# Altium schematic sheet legacy-codec.SchDoc: audiolab
size A3; Author: Martín Ramírez Espinosa; Revision: 1.0; SheetNumber: 2; SheetTotal: 3
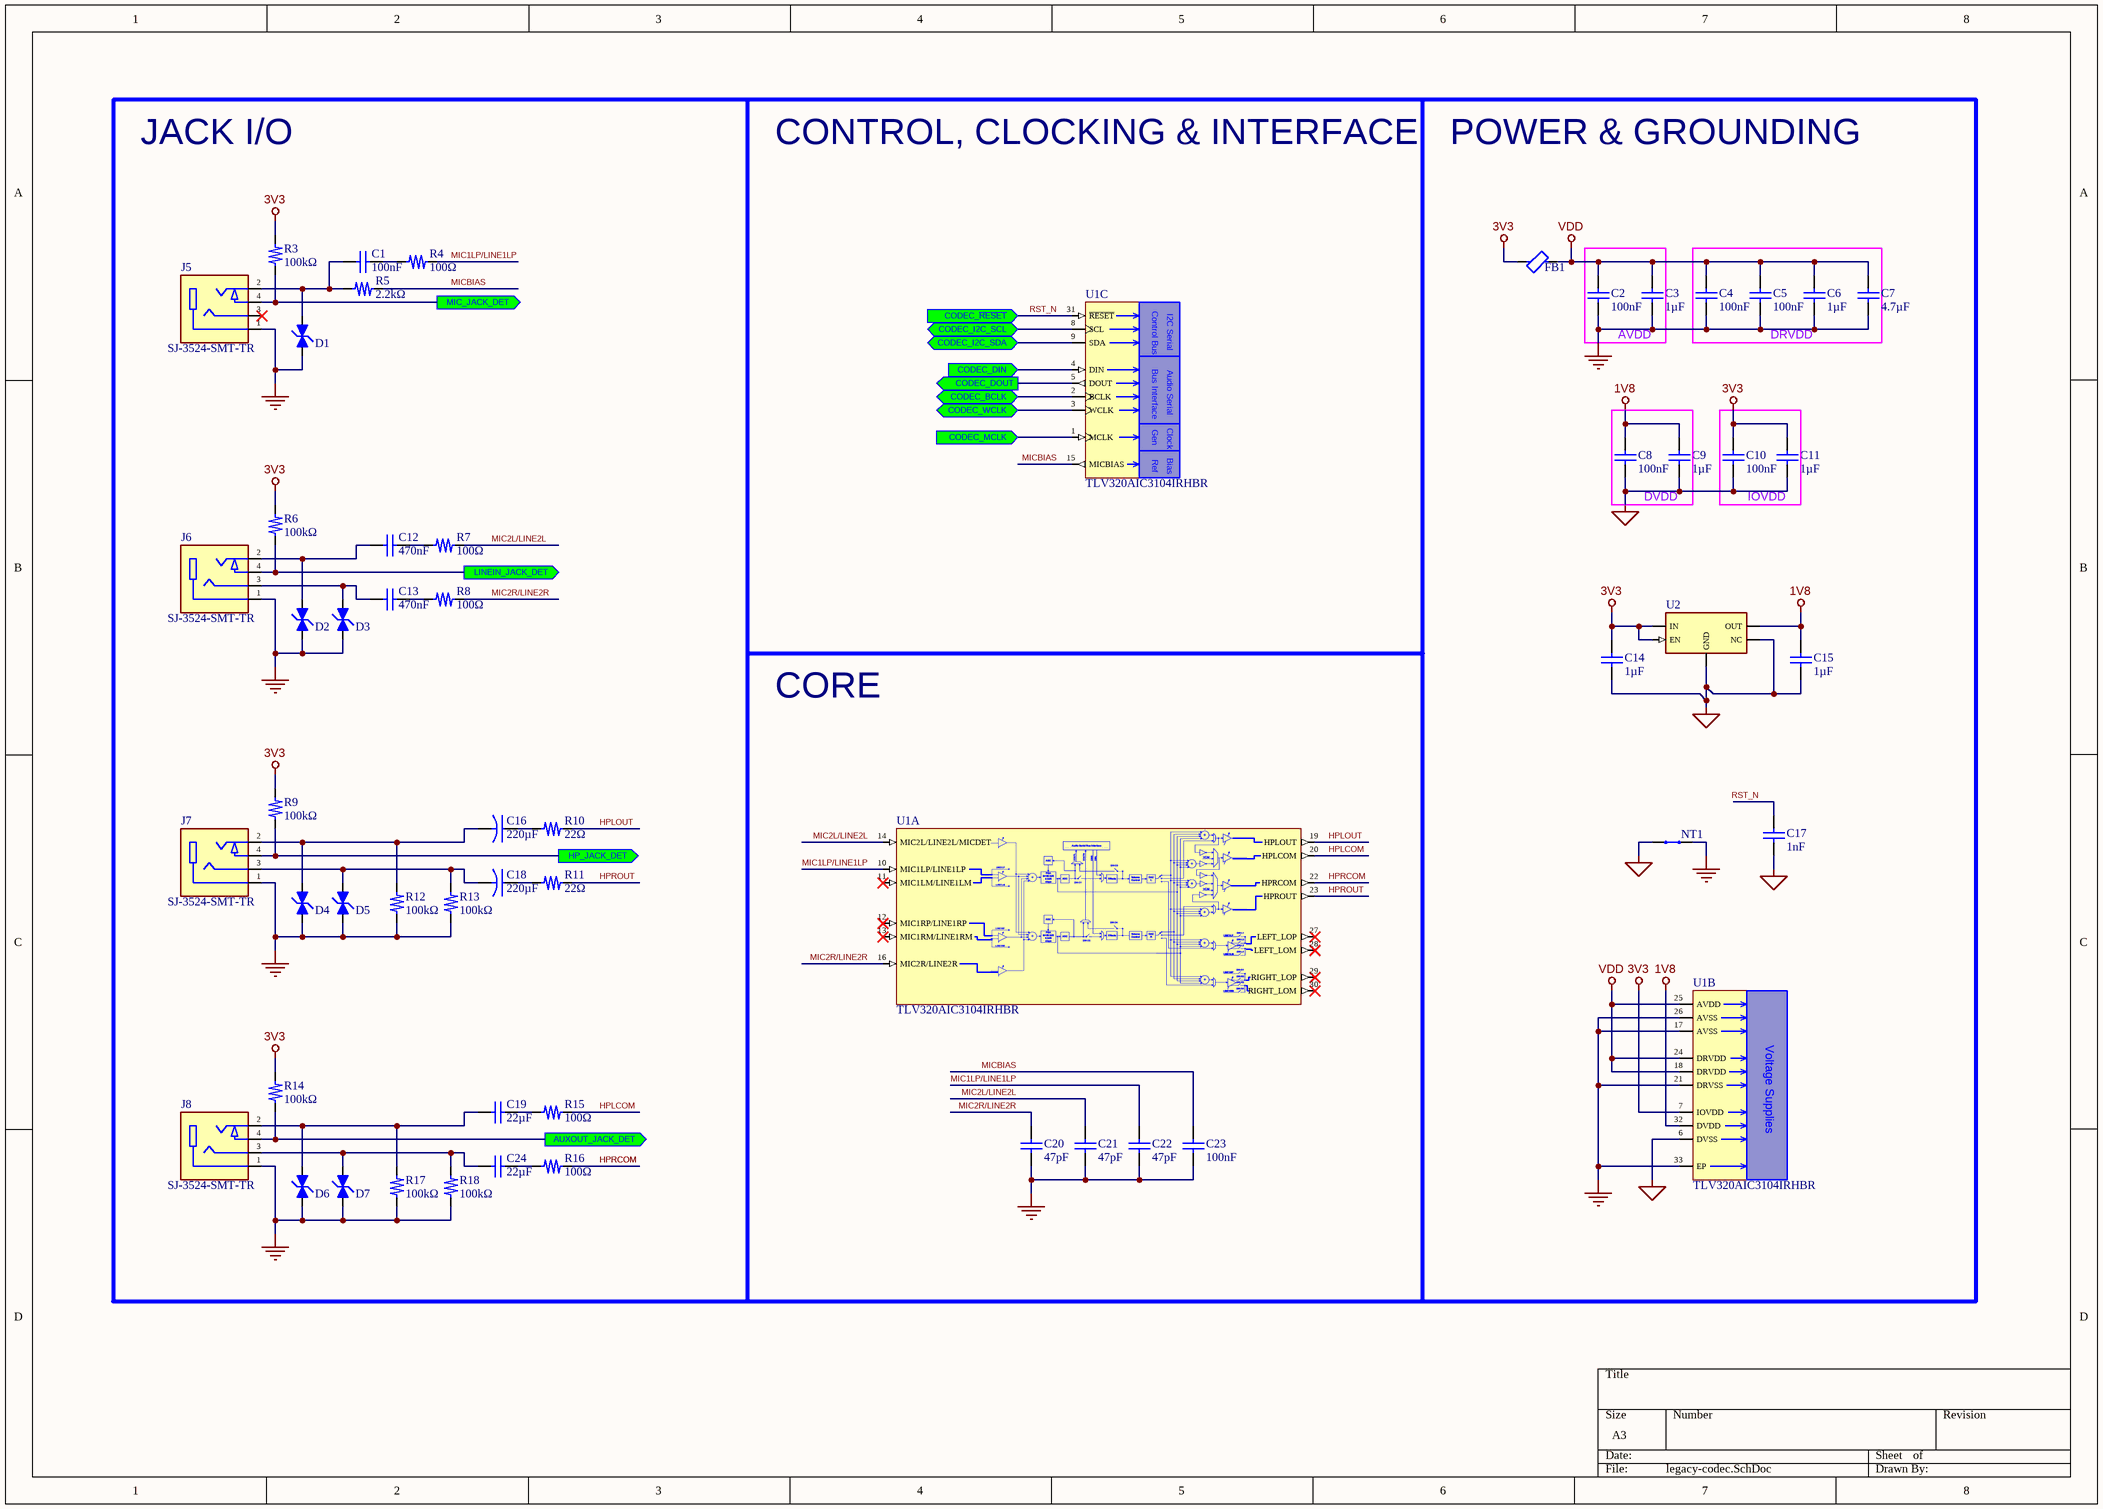
[diagram p0: legacy-codec.SchDoc]

## Parts
C1  value 100nF  [CAPC2012X135N]  (hidden comment: CC0805KRX7R9BB104)
C2  value 100nF  [CAPC2012X135N]  (hidden comment: CC0805KRX7R9BB104)
C3  value 1µF  [CAPC2012X135N]  (hidden comment: CL21B105KBFNNNE)
C4  value 100nF  [CAPC2012X135N]  (hidden comment: CC0805KRX7R9BB104)
C5  value 100nF  [CAPC2012X135N]  (hidden comment: CC0805KRX7R9BB104)
C6  value 1µF  [CAPC2012X135N]  (hidden comment: CL21B105KBFNNNE)
C7  value 4.7µF  [CAPC2012X135N]  (hidden comment: CC0805KKX5R8BB475)
C8  value 100nF  [CAPC2012X135N]  (hidden comment: CC0805KRX7R9BB104)
C9  value 1µF  [CAPC2012X135N]  (hidden comment: CL21B105KBFNNNE)
C10  value 100nF  [CAPC2012X135N]  (hidden comment: CC0805KRX7R9BB104)
C11  value 1µF  [CAPC2012X135N]  (hidden comment: CL21B105KBFNNNE)
C12  value 470nF  [CAPC2012X135N]  (hidden comment: C0805C474K5RECTU)
C13  value 470nF  [CAPC2012X135N]  (hidden comment: C0805C474K5RECTU)
C14  value 1µF  [CAPC2012X135N]  (hidden comment: CL21B105KBFNNNE)
C15  value 1µF  [CAPC2012X135N]  (hidden comment: CL21B105KBFNNNE)
C16  value 220µF  [CAPPRD500W60D800H1150]  (hidden comment: EEU-FR1E221B)
C17  value 1nF  [CAPC2012X135N]  (hidden comment: C0805C102KDRACAUTO)
C18  value 220µF  [CAPPRD500W60D800H1150]  (hidden comment: EEU-FR1E221B)
C19  value 22µF  [CAPC2012X135N]  (hidden comment: GRM21BR61A226ME44L)
C20  value 47pF  [CAPC2012X135N]  (hidden comment: CL21C470JBANNNC)
C21  value 47pF  [CAPC2012X135N]  (hidden comment: CL21C470JBANNNC)
C22  value 47pF  [CAPC2012X135N]  (hidden comment: CL21C470JBANNNC)
C23  value 100nF  [CAPC2012X135N]  (hidden comment: CC0805KRX7R9BB104)
C24  value 22µF  [CAPC2012X135N]  (hidden comment: GRM21BR61A226ME44L)
D1  0402ESDA-AEC1  [0402ESDAAEC1-MFR]  (value not drawn)
D2  0402ESDA-AEC1  [0402ESDAAEC1-MFR]  (value not drawn)
D3  0402ESDA-AEC1  [0402ESDAAEC1-MFR]  (value not drawn)
D4  0402ESDA-AEC1  [0402ESDAAEC1-MFR]  (value not drawn)
D5  0402ESDA-AEC1  [0402ESDAAEC1-MFR]  (value not drawn)
D6  0402ESDA-AEC1  [0402ESDAAEC1-MFR]  (value not drawn)
D7  0402ESDA-AEC1  [0402ESDAAEC1-MFR]  (value not drawn)
FB1  BLM21PG221SN1D  [FP-BLM21-0_2-t0_85-e0_5-MFG]  (value not drawn)
J5  SJ-3524-SMT-TR  [AUDIOJACK_RA_SMT_3P5_TRS_1SW]
J6  SJ-3524-SMT-TR  [AUDIOJACK_RA_SMT_3P5_TRS_1SW]
J7  SJ-3524-SMT-TR  [AUDIOJACK_RA_SMT_3P5_TRS_1SW]
J8  SJ-3524-SMT-TR  [AUDIOJACK_RA_SMT_3P5_TRS_1SW]
NT1  NetTie_SMD  [NETTIE_SMD]  (value not drawn)  (net tie, no BOM)
R3  value 100kΩ  [RESC2012]  (hidden comment: RC0805FR-07100KL)
R4  value 100Ω  [RESC2012]  (hidden comment: RC0805FR-07100RL)
R5  value 2.2kΩ  [RESC2012]  (hidden comment: RC0805FR-072K2L)
R6  value 100kΩ  [RESC2012]  (hidden comment: RC0805FR-07100KL)
R7  value 100Ω  [RESC2012]  (hidden comment: RC0805FR-07100RL)
R8  value 100Ω  [RESC2012]  (hidden comment: RC0805FR-07100RL)
R9  value 100kΩ  [RESC2012]  (hidden comment: RC0805FR-07100KL)
R10  value 22Ω  [RESC2012]  (hidden comment: CR0805-JW-220ELF)
R11  value 22Ω  [RESC2012]  (hidden comment: CR0805-JW-220ELF)
R12  value 100kΩ  [RESC2012]  (hidden comment: RC0805FR-07100KL)
R13  value 100kΩ  [RESC2012]  (hidden comment: RC0805FR-07100KL)
R14  value 100kΩ  [RESC2012]  (hidden comment: RC0805FR-07100KL)
R15  value 100Ω  [RESC2012]  (hidden comment: RC0805FR-07100RL)
R16  value 100Ω  [RESC2012]  (hidden comment: RC0805FR-07100RL)
R17  value 100kΩ  [RESC2012]  (hidden comment: RC0805FR-07100KL)
R18  value 100kΩ  [RESC2012]  (hidden comment: RC0805FR-07100KL)
U1  TLV320AIC3104IRHBR  [QFN50P500X500X100_HS-33N]  (parts A,B,C of 3)
U2  TLV70018DDCR  [SOT95P280X110-5N]  (value not drawn)

## Blocks framed on the sheet
AVDD: C2 C3
DRVDD: C4-C7
DVDD: C8 C9
IOVDD: C10 C11

## Ports
AUXOUT_JACK_DET (out, see audiolab[3C]), CODEC_BCLK (bidir, see audiolab[3B]), CODEC_DIN (in, see audiolab[3C]), CODEC_DOUT (out, see audiolab[3C]), CODEC_I2C_SCL (bidir, see audiolab[3C]), CODEC_I2C_SDA (bidir, see audiolab[3C]), CODEC_MCLK (in, see audiolab[3B]), CODEC_WCLK (bidir, see audiolab[3B]), CODEC_~{RESET} (in, see audiolab[3C]), HP_JACK_DET (out, see audiolab[3C]), LINEIN_JACK_DET (out, see audiolab[3C]), MIC_JACK_DET (out, see audiolab[3C])

## Nets
1V8: C8.2 C9.2 C15.2 U1.32(DVDD) U2.5(OUT)
3V3: C10.2 C11.2 C14.2 FB1.2 R3.2 R6.2 R9.2 R14.2 U1.7(IOVDD) U2.1(IN) U2.3(EN)
AGND: C2.1 C3.1 C4.1 C5.1 C6.1 C7.1 C20.1 C21.1 C22.1 C23.1 D1.1 D2.1 D3.1 D4.1 D5.1 D6.1 D7.1 J5.1(sleeve) J6.1(sleeve) J7.1(sleeve) J8.1(sleeve) NT1.2 R12.1 R13.1 R17.1 R18.1 U1.17(AVSS) U1.21(DRVSS) U1.26(AVSS) U1.33(EP)
DGND: C8.1 C9.1 C10.1 C11.1 C14.1 C15.1 C17.1 NT1.1 U1.6(DVSS) U2.2(GND) U2.4(NC)
VDD: C2.2 C3.2 C4.2 C5.2 C6.2 C7.2 FB1.1 U1.18(DRVDD) U1.24(DRVDD) U1.25(AVDD)
AUXOUT_JACK_DET: J8.4(tip_switch) R14.1 ; port AUXOUT_JACK_DET
CODEC_BCLK: U1.2(BCLK) ; port CODEC_BCLK
CODEC_DIN: U1.4(DIN) ; port CODEC_DIN
CODEC_DOUT: U1.5(DOUT) ; port CODEC_DOUT
CODEC_I2C_SCL: U1.8(SCL) ; port CODEC_I2C_SCL
CODEC_I2C_SDA: U1.9(SDA) ; port CODEC_I2C_SDA
CODEC_MCLK: U1.1(MCLK) ; port CODEC_MCLK
CODEC_WCLK: U1.3(WCLK) ; port CODEC_WCLK
HP_JACK_DET: J7.4(tip_switch) R9.1 ; port HP_JACK_DET
HPLCOM: R15.1 U1.20(HPLCOM)
HPLOUT: R10.1 U1.19(HPLOUT)
HPRCOM: R16.1 U1.22(HPRCOM)
HPROUT: R11.1 U1.23(HPROUT)
LINEIN_JACK_DET: J6.4(tip_switch) R6.1 ; port LINEIN_JACK_DET
MIC1LP/LINE1LP: C22.2 R4.2 U1.10(MIC1LP/LINE1LP)
MIC2L/LINE2L: C21.2 R7.1 U1.14(MIC2L/LINE2L/MICDET)
MIC2R/LINE2R: C20.2 R8.1 U1.16(MIC2R/LINE2R)
MIC_JACK_DET: J5.4(tip_switch) R3.1 ; port MIC_JACK_DET
MICBIAS: C23.2 R5.1 U1.15(MICBIAS)
RST_N: C17.2 U1.31(~{RESET}) ; port CODEC_~{RESET}
NetC1_1: C1.1 R4.1
NetC1_2: C1.2 D1.2 J5.2(tip) R5.2
NetC12_1: C12.1 R7.2
NetC12_2: C12.2 D2.2 J6.2(tip)
NetC13_1: C13.1 R8.2
NetC13_2: C13.2 D3.2 J6.3(ring)
NetC16_N: C16.N D4.2 J7.2(tip) R12.2
NetC16_P: C16.P R10.2
NetC18_N: C18.N D5.2 J7.3(ring) R13.2
NetC18_P: C18.P R11.2
NetC19_1: C19.1 D6.2 J8.2(tip) R17.2
NetC19_2: C19.2 R15.2
NetC24_1: C24.1 D7.2 J8.3(ring) R18.2
NetC24_2: C24.2 R16.2

Not connected (* = marked no-connect by the designer): J5 3(ring)*; U1 11(MIC1LM/LINE1LM)* 12(MIC1RP/LINE1RP)* 13(MIC1RM/LINE1RM)* 27(LEFT_LOP)* 28(LEFT_LOM)* 29(RIGHT_LOP)* 30(RIGHT_LOM)*

## Notes on the sheet
- JACK I/O
- CONTROL, CLOCKING & INTERFACE
- POWER & GROUNDING
- CORE
- (in symbol TLV320AIC3104IRHBR, part B) Voltage Supplies
- (in symbol TLV320AIC3104IRHBR, part C) Control Bus; I2C Serial; Bus Interface; Audio Serial; Gen; Clock; Ref; Bias

## Library data of the parts
C1 C2 C4 C5 C8 C10 C23 = CC0805KRX7R9BB104: 50V 100nF X7R ±10% 0805 Multilayer Ceramic Capacitors MLCC - SMD/SMT ROHS; Manufacturer: YAGEO; Supplier: DigiKey; Supplier Part Number: 311-1140-1-ND; Manufacturer Part Number: CC0805KRX7R9BB104; Package/Case: 0805 (2012 Metric)
C3 C6 C9 C11 C14 C15 = CL21B105KBFNNNE: 50V 1uF X7R ±10% 0805 Multilayer Ceramic Capacitors MLCC - SMD/SMT ROHS; Manufacturer: Samsung Electro-Mechanics; Supplier: DigiKey; Supplier Part Number: 1276-1029-1-ND; Manufacturer Part Number: CL21B105KBFNNNE; Package/Case: 0805 (2012 Metric)
C7 = CC0805KKX5R8BB475: 25V 4.7uF X5R ±10% 0805 Multilayer Ceramic Capacitors MLCC - SMD/SMT ROHS; Manufacturer: YAGEO; Supplier: DigiKey; Supplier Part Number: 311-1871-1-ND; Manufacturer Part Number: CC0805KKX5R8BB475; Package/Case: 0805 (2012 Metric)
C12 C13 = C0805C474K5RECTU: Ceramic Capacitor, Multilayer, Ceramic, 50V, 10% +Tol, 10% -Tol, X7R, 15% TC, 0.47uF, Surface Mount, 0805; Manufacturer: KEMET; Supplier: DigiKey; Supplier Part Number: 399-C0805C474K5RECTUCT-ND; Manufacturer Part Number: KEMET; Package/Case: 0805 (2012 Metric)
C16 C18 = EEU-FR1E221B: Radial Can ALUMINUM ELECTROLYTIC CAPACITOR FR 25V 220muF ±20% 0.315Dia 8.00mm; Manufacturer: Panasonic Electronic Components; Supplier: DigiKey; Supplier Part Number: P124224CT-ND; Manufacturer Part Number: EEU-FR1E221B; Package/Case: Radial, Can
C17 = C0805C102KDRACAUTO: Multilayer Ceramic Capacitors MLCC - SMD/SMT 1kV 1000pF X7R 0805 10% AEC-Q200; Manufacturer: KEMET; Supplier: DigiKey; Supplier Part Number: 399-16643-1-ND; Manufacturer Part Number: C0805C102KDRACAUTO; Package/Case: 0805 (2012 Metric)
C19 C24 = GRM21BR61A226ME44L: 0805 22 uF 10 V ±20% Tolerance X5R Multilayer Ceramic Chip Capacitor; Manufacturer: Murata Electronics; Supplier: DigiKey; Supplier Part Number: 490-10746-1-ND; Manufacturer Part Number: GRM21BR61A226ME44L; Package/Case: 0805 (2012 Metric)
C20-C22 = CL21C470JBANNNC: 50V 47pF C0G ±5% 0805 Multilayer Ceramic Capacitors MLCC - SMD/SMT ROHS; Manufacturer: Samsung Electro-Mechanics; Supplier: LCSC; Supplier Part Number: C14857; Manufacturer Part Number: CL21C470JBANNNC; Package/Case: 0805 (2012 Metric)
D1-D7 = 0402ESDA-AEC1: ESD Suppressor Diode TVS Bi-Dir 30V 35Vc 2-Pin Case 0402(1005Metric) T/R; Manufacturer: Eaton; Supplier: Digikey; Supplier Part Number: 283-0402ESDA-AEC1CT-ND; Manufacturer Part Number: 0402ESDA-AEC1; Value: *; Package/Case: *
FB1 = BLM21PG221SN1D: 220 Ohms @ 100 MHz 1 Power Line Ferrite Bead 0805 (2012 Metric) 2A 45mOhm
J5-J8 = SJ-3524-SMT-TR: 3.5 mm, Stereo, Right Angle, Surface Mount (SMT), Audio Jack Connector
NT1 = NetTie_SMD: Net Tie SMD
R3 R6 R9 R12-R14 R17 R18 = RC0805FR-07100KL: 125Mw Thick Film Resistors 100Ppm/ 1% 100K 0805 Chip Resistor Surface Mount Rohs; Manufacturer: YAGEO; Supplier: DigiKey; Supplier Part Number: 311-100KCRCT-ND; Manufacturer Part Number: RC0805FR-07100KL; Package/Case: 0805 (2012 Metric)
R4 R7 R8 R15 R16 = RC0805FR-07100RL: 125Mw Thick Film Resistors 100Ppm/ 1% 100 0805 Chip Resistor Surface Mount Rohs; Manufacturer: YAGEO; Supplier: DigiKey; Supplier Part Number: 311-100CRCT-ND; Manufacturer Part Number: RC0805FR-07100RL; Package/Case: 0805 (2012 Metric)
R5 = RC0805FR-072K2L: 125Mw Thick Film Resistors 100Ppm/ 1% 2.2K 0805 Chip Resistor Surface Mount Rohs; Manufacturer: YAGEO; Supplier: DigiKey; Supplier Part Number: 311-2.20KCRCT-ND; Manufacturer Part Number: RC0805FR-072K2L; Package/Case: 0805 (2012 Metric)
R10 R11 = CR0805-JW-220ELF: Res Thick Film 0805 22 Ohm 5% 1/8W ±200ppm/°C Molded SMD SMD Paper Tape on Plastic Reel; Manufacturer: Bourns Inc.; Supplier: DigiKey; Supplier Part Number: 118-CR0805-JW-220ELFCT-ND; Manufacturer Part Number: CR0805-JW-220ELF; Package/Case: 0805 (2012 Metric)
U1 = TLV320AIC3104IRHBR: Low-Power Stereo CODEC with 6 Inputs, 6 Outputs, HP Amp and Enhanced Digital Effects; Manufacturer: Texas Instruments; Value: *; Supplier Part Number: 296-26818-1-ND; Supplier: DigiKey; Manufacturer Part Number: TLV320AIC3104IRHBR; Package/Case: 32-VFQFN Exposed Pad
U2 = TLV70018DDCR: 200-mA, high-PSRR, low-IQ, low-dropout voltage regulator with enable 5-SOT-23-THIN -40 to 125